# EAGLE design miniecu-v1.0c (EAGLE 6.5.0)
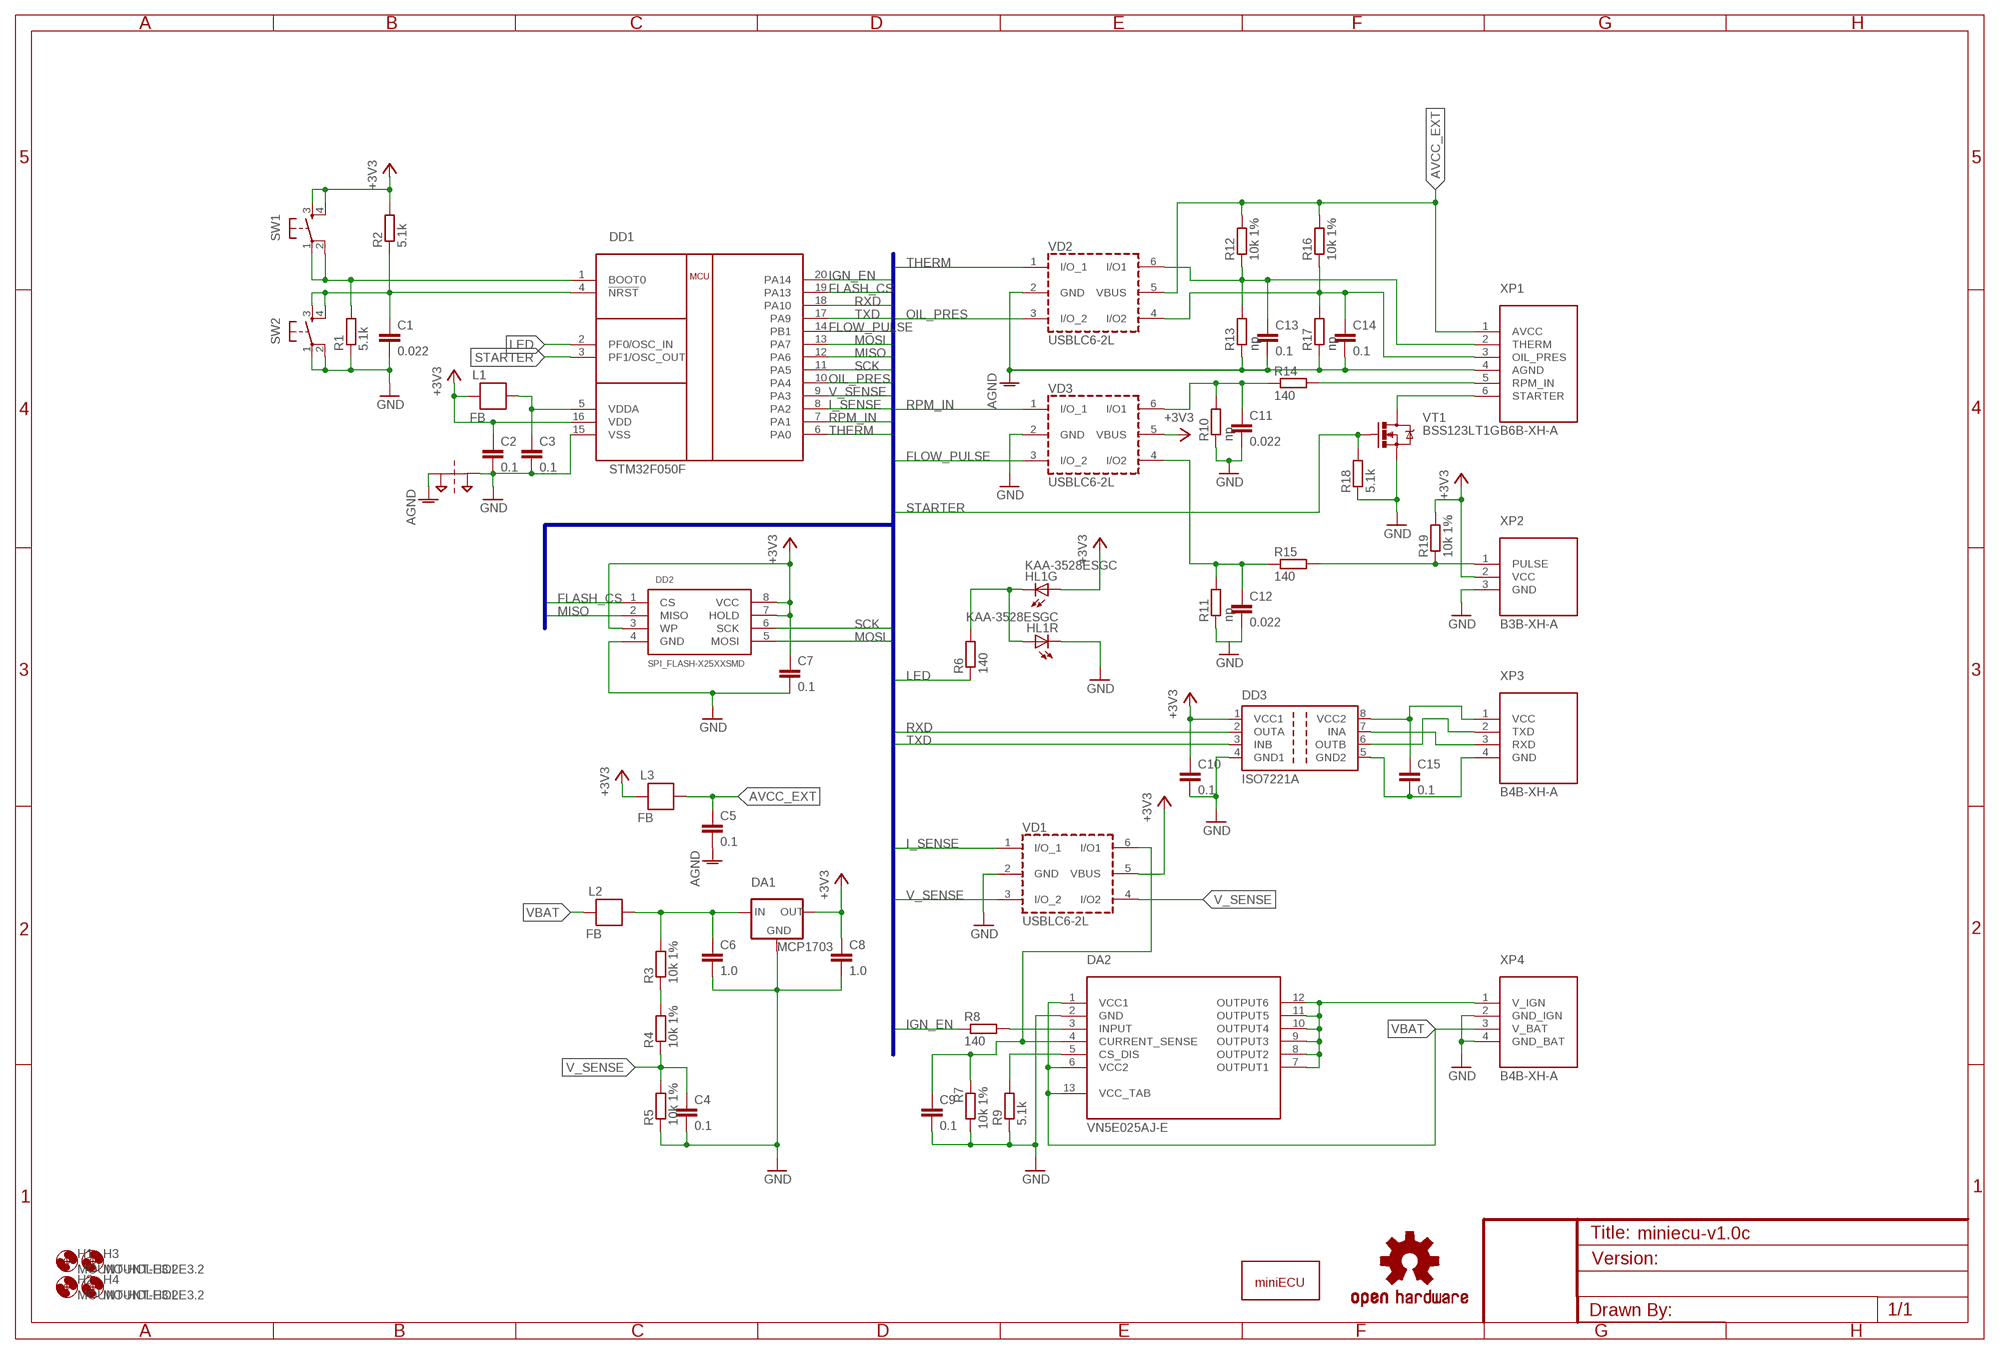
[diagram p0: schematic, sheet 1]

## Parts
C1  0.022  C-EUC0603  [C0603]
C2  0.1  C-EUC0603  [C0603]
C3  0.1  C-EUC0603  [C0603]
C4  0.1  C-EUC0603  [C0603]
C5  0.1  C-EUC0603  [C0603]
C6  1.0  C-EUC0805  [C0805]
C7  0.1  C-EUC0603  [C0603]
C8  1.0  C-EUC0805  [C0805]
C9  0.1  C-EUC0603  [C0603]
C10  0.1  C-EUC0603  [C0603]
C11  0.022  C-EUC0603  [C0603]
C12  0.022  C-EUC0603  [C0603]
C13  0.1  C-EUC0603  [C0603]
C14  0.1  C-EUC0603  [C0603]
C15  0.1  C-EUC0603  [C0603]
DA1  MCP1703  MCP1700SOT-23  [SOT23]
DA2  VN5E025AJ-E  [POWERSSO-12]
DD1  STM32F050F  [TSSOP20]
DD2  SPI_FLASH-X25XXSMD  [SO08]
DD3  ISO7221A  [SO-08]
H1  MOUNT-HOLE3.2  [3,2]
H2  MOUNT-HOLE3.2  [3,2]
H3  MOUNT-HOLE3.2  [3,2]
H4  MOUNT-HOLE3.2  [3,2]
HL1  KAA-3528ESGC  [KA-3528]
L1  FB  [0603]
L2  FB  [0603]
L3  FB  [0603]
LOGO1  OSHW-LOGOL  [OSHW-LOGO-L]
LOGO2  MINIECU_LOGO  [MINIECU_LOGO]
PT1  2PT_GND_TIE  [2PT_GND_TIE]
R1  5.1k  R-EU_R0603  [R0603]
R2  5.1k  R-EU_R0603  [R0603]
R3  10k 1%  R-EU_R0805  [R0805]
R4  10k 1%  R-EU_R0805  [R0805]
R5  10k 1%  R-EU_R0805  [R0805]
R6  140  R-EU_R0603  [R0603]
R7  10k 1%  R-EU_R0805  [R0805]
R8  140  R-EU_R0603  [R0603]
R9  5.1k  R-EU_R0603  [R0603]
R10  np  R-EU_R0603  [R0603]
R11  np  R-EU_R0603  [R0603]
R12  10k 1%  R-EU_R0805  [R0805]
R13  np  R-EU_R0805  [R0805]
R14  140  R-EU_R0603  [R0603]
R15  140  R-EU_R0603  [R0603]
R16  10k 1%  R-EU_R0805  [R0805]
R17  np  R-EU_R0805  [R0805]
R18  5.1k  R-EU_R0603  [R0603]
R19  10k 1%  R-EU_R0805  [R0805]
SW1  TAC_SWITCHSMD  [TACTILE_SWITCH_SMD]
SW2  TAC_SWITCHSMD  [TACTILE_SWITCH_SMD]
VD1  USBLC6-2L  USBLC6-2SC6  [SOT-23-6L]
VD2  USBLC6-2L  USBLC6-2SC6  [SOT-23-6L]
VD3  USBLC6-2L  USBLC6-2SC6  [SOT-23-6L]
VT1  BSS123LT1G  MOSFET-NCHANNELBSS123LT1G  [SOT23]
XP1  B6B-XH-A  SENSORS-B6B-XH-A  [B6B-XH]
XP2  B3B-XH-A  FLOW_SENS-B3B-XH-A  [B3B-XH]
XP3  B4B-XH-A  UART-B4B-XH-A  [B4B-XH]
XP4  B4B-XH-A  IGN_POWER-B4B-XH-A  [B4B-XH]

## Nets
!NRST: C1.1 DD1.4(!NRST) R2.1 SW2.3 SW2.4
+3V3: C2.1 C7.1 C8.1 C10.1 DA1.2(OUT) DD1.16(VDD) DD2.3(WP) DD2.7(HOLD) DD2.8(VCC) DD3.1(VCC1) HL1.4(G:A) L1.2 L3.2 R2.2 R19.2 SW1.3 SW1.4 VD1.5(VBUS) VD3.5(VBUS) XP2.2(VCC)
AGND: C5.2 C13.2 C14.2 PT1.P$1 R13.1 R17.1 VD2.2(GND) XP1.4(AGND)
AVCC: C3.1 DD1.5(VDDA) L1.1
AVCC_EXT: C5.1 L3.1 R12.2 R16.2 VD2.5(VBUS) XP1.1(AVCC)
BOOT0: DD1.1(BOOT0) R1.2 SW1.1 SW1.2
FLASH_CS: DD1.19(PA13) DD2.1(CS)
FLOW_PULSE: C12.1 DD1.14(PB1) R11.2 R15.1 VD3.3(I/O_2) VD3.4(I/O2)
GND: C1.2 C2.2 C3.2 C4.2 C6.2 C7.2 C8.2 C9.2 C10.2 C11.2 C12.2 DA1.1(GND) DA2.2(GND) DD1.15(VSS) DD2.4(GND) DD3.4(GND1) HL1.1(R:C) PT1.P$2 R1.1 R5.1 R7.2 R9.1 R10.1 R11.1 R18.1 SW2.1 SW2.2 VD1.2(GND) VD3.2(GND) VT1.2(S) XP2.3(GND) XP4.2(GND_IGN) XP4.4(GND_BAT)
GND2: C15.2 DD3.5(GND2) XP3.4(GND)
I_SENSE: C9.1 DA2.4(CURRENT_SENSE) DD1.8(PA2) R7.1 VD1.1(I/O_1) VD1.6(I/O1)
IGN_EN: DD1.20(PA14) R8.1
IORXD: DD3.7(INA) XP3.3(RXD)
IOTXD: DD3.6(OUTB) XP3.2(TXD)
LED: DD1.2(PF0/OSC_IN) R6.1
MISO: DD1.12(PA6) DD2.2(MISO)
MOSI: DD1.13(PA7) DD2.5(MOSI)
N$1: R3.1 R4.2
N$2: HL1.2(R:A) HL1.3(G:C) R6.2
N$4: R15.2 R19.1 XP2.1(PULSE)
N$6: C6.1 DA1.3(IN) L2.1 R3.2
N$7: DA2.3(INPUT) R8.2
N$9: DA2.5(CS_DIS) R9.2
OIL_PRES: C14.1 DD1.10(PA4) R16.1 R17.2 VD2.3(I/O_2) VD2.4(I/O2) XP1.3(OIL_PRES)
RPM_IN: C11.1 DD1.7(PA1) R10.2 R14.1 VD3.1(I/O_1) VD3.6(I/O1)
RPM_IN_CON: R14.2 XP1.5(RPM_IN)
RXD: DD1.18(PA10) DD3.2(OUTA)
SCK: DD1.11(PA5) DD2.6(SCK)
STARTER: DD1.3(PF1/OSC_OUT) R18.2 VT1.1(G)
STARTER_OUT: VT1.3(D) XP1.6(STARTER)
THERM: C13.1 DD1.6(PA0) R12.1 R13.2 VD2.1(I/O_1) VD2.6(I/O1) XP1.2(THERM)
TXD: DD1.17(PA9) DD3.3(INB)
V_IGN: DA2.7(OUTPUT1) DA2.8(OUTPUT2) DA2.9(OUTPUT3) DA2.10(OUTPUT4) DA2.11(OUTPUT5) DA2.12(OUTPUT6) XP4.1(V_IGN)
V_SENSE: C4.1 DD1.9(PA3) R4.1 R5.2 VD1.3(I/O_2) VD1.4(I/O2)
VBAT: DA2.1(VCC1) DA2.6(VCC2) DA2.13(VCC_TAB) L2.2 XP4.3(V_BAT)
VCC2: C15.1 DD3.8(VCC2) XP3.1(VCC)

## Buses
TXD,RXD,RPM_IN,FLOW_PULSE,STARTER,THERM,OIL_PRES,MISO,MOSI,SCK,FLASH_CS,IGN_EN,V_SENSE,I_SENSE,LED_RED

## Library data of the parts
C1-C15 = resistor:C-EU: CAPACITOR, European symbol
DA1 = power-ic:MCP1700: VOLTAGE REGULATOR
DA2 = power-ic:VN5E025AJ: Single channel high-side driver with analog current sense for automotive applications Features Max supply voltage VCC 41 V Operating voltage range VCC 4.5 to 28 V Max On-State resistance RON 25 mΩ Current limitation (typ) ILIMH 60 A Off state supply current IS 2 μA
DD1 = stm32f050:STM32F050F: STM32F050F - Coretex-M0 48 MHz; 4 kB RAM; 16/32 kB FLASH
DD2 = SparkFun-DigitalIC:SPI_FLASH-X25XX: 8pin SPI Flash series x25xx. Works with devices like W25X32 and BR25L32
DD3 = texas:ISO7221: DUAL DIGITAL ISOLATORS Source: http://focus.ti.com/lit/ds/symlink/iso7221a.pdf; MPN: ISO7221AD; OC_FARNELL: 1390651; OC_NEWARK: 48M0672
H1-H4 = holes:MOUNT-HOLE: MOUNTING HOLE with drill center marker
HL1 = led2:KAA-3528ESGC: KAA-3528ESGC Kingbright® 3.5x2.8mm SURFACE MOUNT LED LAMPS
L1-L3 = SparkFun-Passives:FB
LOGO1 = SparkFun-Aesthetics:OSHW-LOGO: Open Source Hardware Logo This logo indicates the piece of hardware it is found on incorporates a OSHW license and/or adheres to the definition of open source hardware found here: http://freedomdefined.org/OSHW
LOGO2 = miniecu:MINIECU_LOGO: Logo imported from bmp.
PT1 = SparkFun-Passives:2PT_GND_TIE: Package for connecting two ground nets in one place.
R1-R19 = resistor:R-EU_: RESISTOR, European symbol
SW1 SW2 = SparkFun-Electromechanical:TAC_SWITCH: Momentary Switch Button commonly used for reset or general input. Spark Fun Electronics SKU : COM-00097 SMT- SWCH-08247; PROD_ID: SWCH-08247
VD1-VD3 = usblc6:USBLC6-2: VERY LOW CAPACITANCE ESD PROTECTION 2 line Datasheet link <http://www.st.com/web/catalog/sense_power/FM114/CL1137/SC1489/PF93353>
VT1 = SparkFun-DiscreteSemi:MOSFET-NCHANNEL: Common NMOSFET Parts MFG P/N Store ID Prod ID FDD8780 TRANS-09984 SI7820DN TRANS-11055 FDS6630A IC-08089 2N7002PW TRANS-11151 FQP30N06L COM-10213 TRANS-10060 BSS123LT1G TRANS-08345 BSS138 TRANS-00830 BS170 2N7000; PROD_ID: TRANS-08345
XP1 = miniecu-con:SENSORS: JST XH CONNECTOR JST XH connector for engine sensors
XP2 = miniecu-con:FLOW_SENS: JST XH CONNECTOR B3B-XH JST connector for various liquid flow meters
XP3 = miniecu-con:UART: JST XH CONNECTOR Connector for isolated UART
XP4 = miniecu-con:IGN_POWER: JST XH CONNECTOR Connector for ingition module power switch

## Board
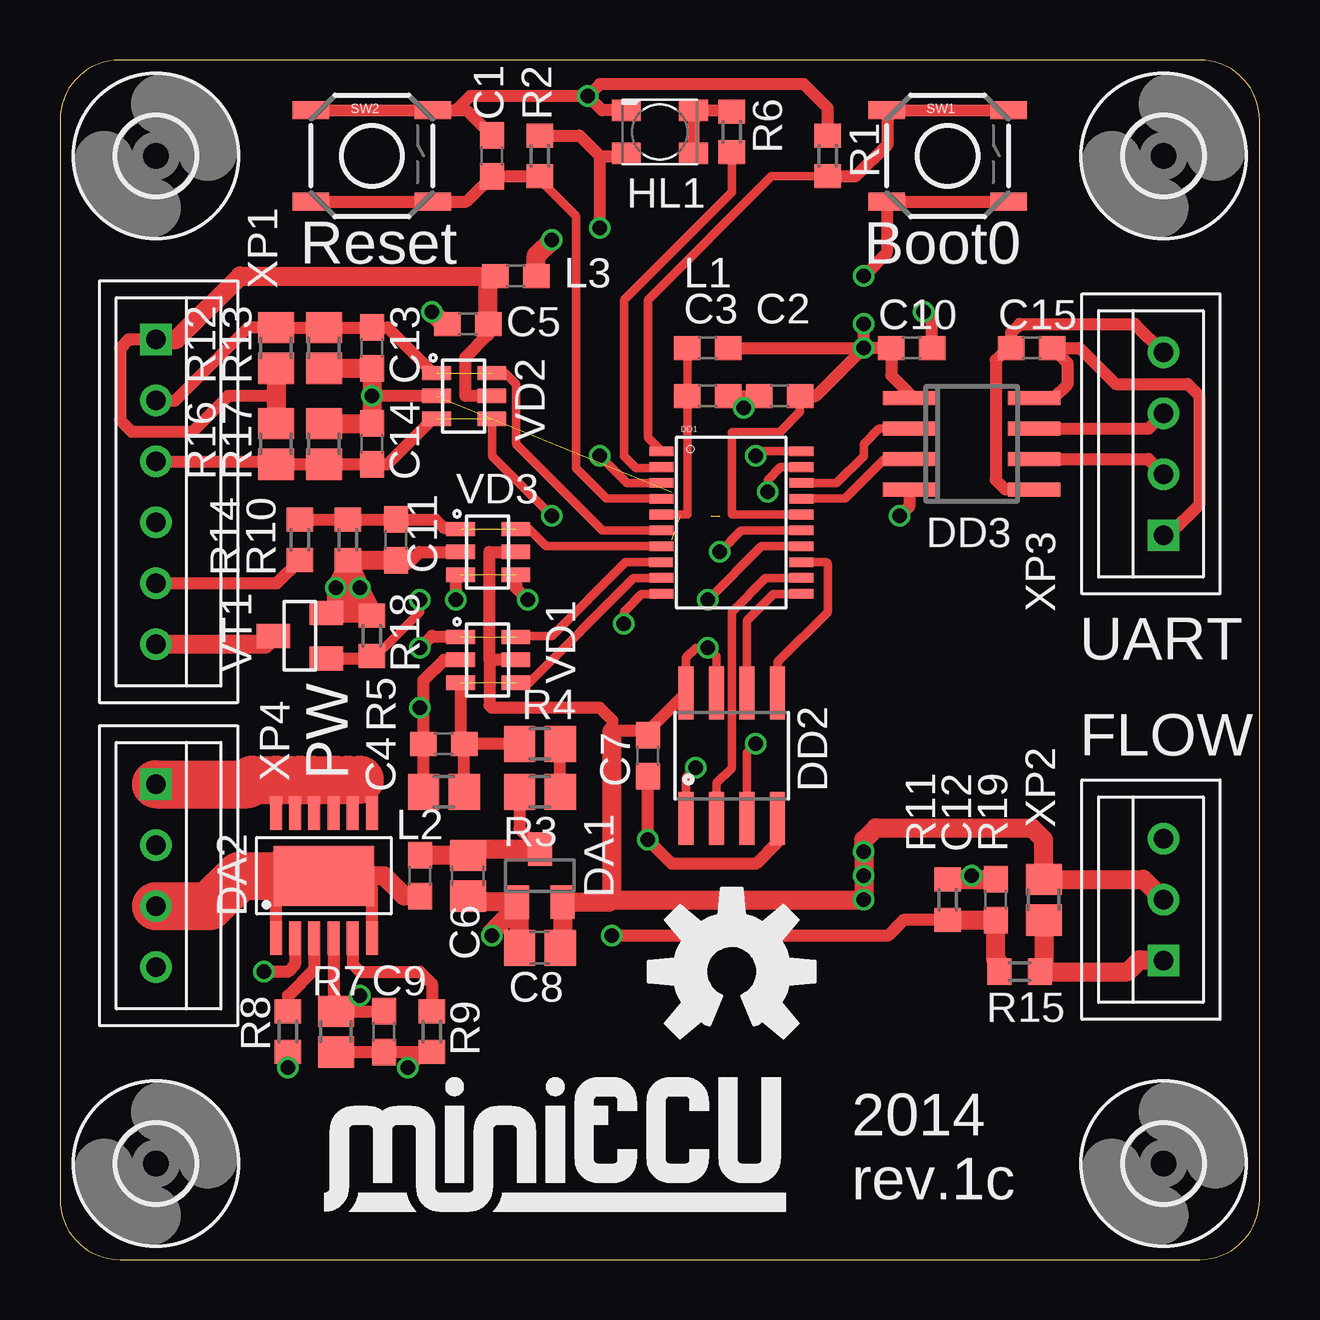
[diagram p1: board, top side]
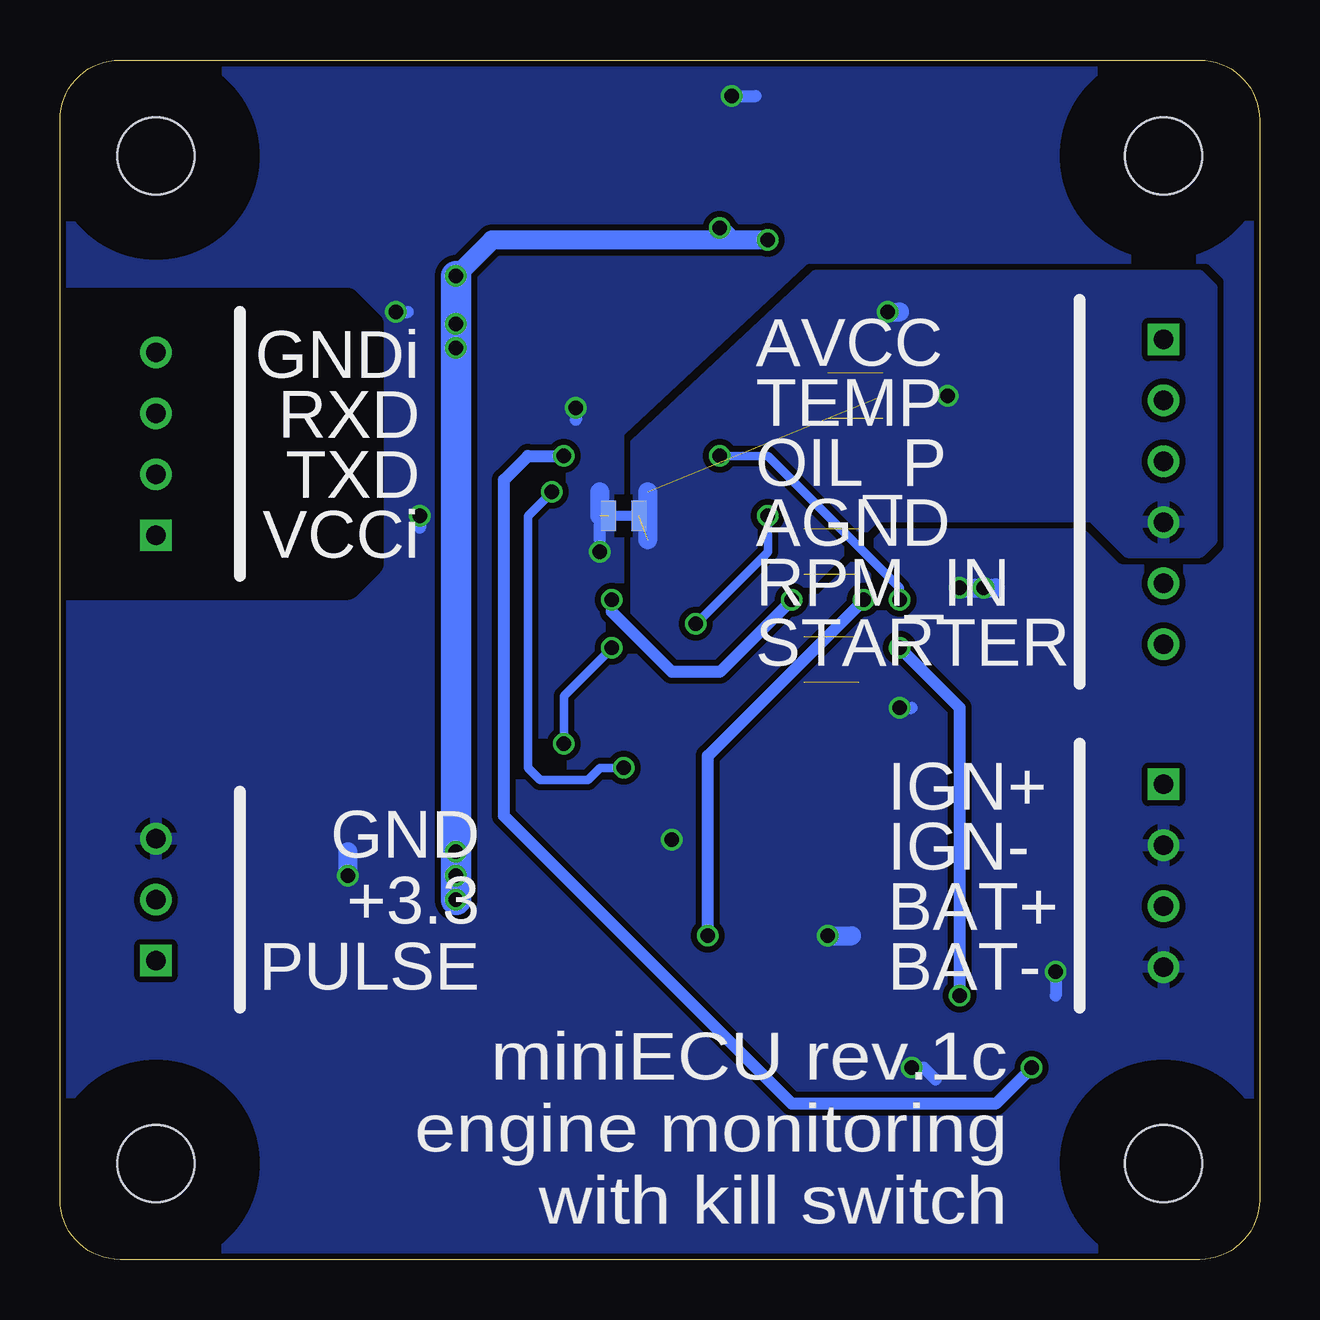
[diagram p2: board, bottom side, seen from below]

Size 50 x 50 mm. Coordinates in mm from the lower left corner, seen from the top.
Outline: 0,2.5 arc90 2.5,0 47.5,0 arc90 50,2.5 50,47.5 arc90 47.5,50 2.5,50 arc90 0,47.5 0,2.5
Copper layers (1*16): Top 0.035mm / dielectric 1.5mm / Bottom 0.035mm
Design rules "ITEADstudio_DRC": minimum track width 6mil, minimum drill 12mil, track to track 6mil, track to pad 6mil, pad to pad 6mil, via to via 6mil, smd to smd 0mil, copper to edge 10mil, drill to drill 10mil, minimum pad ring 10mil, minimum via ring 6mil, stop-mask expansion 2mil, vias tented up to drill 100mil, thermal gap 10mil
bRestrict: area 37,28 to 50,40

### Footprints (pad centres in the part's own frame; a part is rotated, then mirrored left to right if it is on the bottom)
C0603 = smd 1.1 x 1: 1 -0.85,0; 2 0.85,0
C0805 = smd 1.3 x 1.5: 1 -0.85,0; 2 0.85,0
SOT23 = smd 1 x 1.4: 1 -0.95,-1.1; 2 0.95,-1.1; 3 0,1.1
POWERSSO-12 = smd 0.5 x 1.4: 1 -2,-2.6; 2 -1.2,-2.6; 3 -0.4,-2.6; 4 0.4,-2.6; 5 1.2,-2.6; 6 2,-2.6; 7 2,2.6; 8 1.2,2.6; 9 0.4,2.6; 10 -0.4,2.6; 11 -1.2,2.6; 12 -2,2.6 | smd 4.2 x 2.5: 13 0,0
TSSOP20 = smd 1 x 0.4: 1 -2.937,2.693; 2 -2.937,2.032; 3 -2.937,1.372; 4 -2.937,0.712; 5 -2.937,0.051; 6 -2.937,-0.609; 7 -2.937,-1.27; 8 -2.943,-1.93; 9 -2.937,-2.59; 10 -2.937,-3.251; 11 2.905,-3.251; 12 2.905,-2.59; 13 2.911,-1.93; 14 2.905,-1.27; 15 2.905,-0.609; 16 2.905,0.051; 17 2.905,0.712; 18 2.905,1.372; 19 2.905,2.032; 20 2.905,2.693
SO08 = smd 0.61 x 2.21: 1 -1.905,-2.616; 2 -0.635,-2.616; 3 0.635,-2.616; 4 1.905,-2.616; 5 1.905,2.616; 6 0.635,2.616; 7 -0.635,2.616; 8 -1.905,2.616
SO-08 = smd 0.6 x 2.2: 1 -1.905,-2.6; 2 -0.635,-2.6; 3 0.635,-2.6; 4 1.905,-2.6; 5 1.905,2.6; 6 0.635,2.6; 7 -0.635,2.6; 8 -1.905,2.6
3,2 = hole 3.2: 0,0
KA-3528 = smd 1.2 x 0.9: 1 1.4,-0.9; 2 -1.4,-0.9; 3 -1.4,0.9; 4 1.4,0.9
0603 = smd 1.1 x 1: 1 -0.85,0; 2 0.85,0
2PT_GND_TIE = smd 1.27 x 0.635: P$1 0,0.635; P$2 0,-0.635
R0603 = smd 1 x 1.1: 1 -0.85,0; 2 0.85,0
R0805 = smd 1.3 x 1.5: 1 -0.85,0; 2 0.85,0
TACTILE_SWITCH_SMD = smd 1.524 x 0.762: 1 -2.54,1.905; 2 2.54,1.905; 3 -2.54,-1.905; 4 2.54,-1.905
SOT-23-6L = smd 0.6 x 1.2: 1 -0.95,-2.3; 2 0,-2.3; 3 0.95,-2.3; 4 0.95,0; 5 0,0; 6 -0.95,0
B6B-XH = drill 0.8 square: 1 -6.35,0 | drill 0.8: 2 -3.81,0; 3 -1.27,0; 4 1.27,0; 5 3.81,0; 6 6.35,0
B3B-XH = drill 0.8 square: 1 -2.54,0 | drill 0.8: 2 0,0; 3 2.54,0
B4B-XH = drill 0.8 square: 1 -3.81,0 | drill 0.8: 2 -1.27,0; 3 1.27,0; 4 3.81,0

### Placement (x,y rotation side)
C1  18,46 90 top
C2  30,36 180 top
C3  27,36 0 top
C4  16,21.5 180 top
C5  17,39 180 top
C6  17,16 270 top
C7  24.5,21 270 top
C8  20,13 180 top
C9  13.5,9.5 270 top
C10  35.5,38 0 top
C11  14,30 270 top
C12  39,15 90 top
C13  13,38 270 top
C14  13,34 90 top
C15  40.5,38 180 top
DA1  20,16 0 top
DA2  11,16 0 top
DD1  28,31 0 top
DD2  28,21 0 top
DD3  38,34 270 top
H1  46,4 0 top
H2  4,4 0 top
H3  4,46 0 top
H4  46,46 0 top
HL1  25,47 180 top
L1  27,38 0 top
L2  15,16 270 top
L3  19,41 0 top
LOGO1  28,12 0 top
LOGO2  11,2 0 top
PT1  26.5,31 270 bottom
R1  32,46 270 top
R2  20,46 90 top
R3  20,19.5 180 top
R4  20,21.5 0 top
R5  16,19.5 0 top
R6  28,47 90 top
R7  11.5,9.5 270 top
R8  9.5,9.5 90 top
R9  15.5,9.5 90 top
R10  12,30 90 top
R11  37,15 270 top
R12  9,38 270 top
R13  11,38 90 top
R14  10,30 270 top
R15  40,12 0 top
R16  9,34 90 top
R17  11,34 270 top
R18  13,26 270 top
R19  41,15 90 top
SW1  37,46 0 top
SW2  13,46 0 top
VD1  19,25 270 top
VD2  18,36 270 top
VD3  19,29.5 270 top
VT1  10,26 90 top
XP1  4,32 270 top
XP2  46,15 90 top
XP3  46,34 90 top
XP4  4,16 270 top

### Tracks (layer width: path | path; a pad name or v marks a point on that pad's centre or on a via)
!NRST
  Top 0.35: DD1.4 22.79,31.71 21.5,33 21.5,43.5 20,45 R2.1
  Top 0.5: SW2.3 SW2.4 16.95,44.09 C1.1 R2.1
+3V3  (via drill 0.6)
  Top 0.35: DD2.7 27.36,25.14 v27,25.5 26.5,25.5 26.09,25.09 DD2.8 | DD2.3 28.64,21.14 v29,21.5 | DD1.16 28,31.05 28,34.5 30,34.5 30.85,35.35 C2.1
  Top 0.5: R2.2 21.65,46.85 22.5,46 | 22.5,46 23.5,46 HL1.4 | VD1.5 17.9,25 | 17.9,25 17.9,29.5 VD3.5 | C7.1 24.5,22.02 | 24.5,22.02 DD2.8 | 17.9,25 17.9,23.1 18,23 22.5,23 23.02,22.48 23.02,22.02 | 24.5,22.02 23.02,22.02 | 23.02,22.02 23,22 | v22.5,43 22.5,46 | SW1.4 SW1.3 34.46,41.96 v33.5,41 | L1.2 v33.5,38 | v33.5,38 C10.1 34.65,36.85 35.4,36.1 DD3.1 | v33.5,38 v33.5,39 | C2.1 31.5,36 v33.5,38
  Top 0.8: C8.1 20.95,13.1 DA1.2 22.9,14.9 23,15 | XP2.2 45.15,15.85 R19.2 41,17.5 40.5,18 34,18 33.5,17.5 v33.5,17 v33.5,16 v33.5,15 23,15 | 23,15 23,22 | L3.2 19.85,41.85 v20.5,42.5
  Bottom 0.35: v29,21.5 29,23.5 v27,25.5
  Bottom 0.8: v33.5,41 32,42.5 v20.5,42.5 22,42.5 v22.5,43
  Bottom 1.27: v33.5,15 v33.5,16 v33.5,17 v33.5,38 v33.5,39 v33.5,41
AGND  (via drill 0.6)  (2 unrouted)
  Top 0.5: VD2.2 v13,36
  Top 0.8: R13.1 C13.2 v13,36 C14.2 R17.1 | C5.2 16,39 v15.5,39.5
  Bottom 0.8: v15.5,39.5 15,39.5 | 25.5,30 25.5,32
  pour Bottom (isolate 0.254): 5.5,29.5 2.5,29.5 2,30 2,40.5 2.5,41 18.5,41 26,34 26,26.5 24.5,25 22,25 16,31 7,31
AVCC
  Top 0.35: L1.1 C3.1 26.15,31.05 DD1.5
AVCC_EXT
  Top 0.5: VD2.5 16.9,36 16.9,37.6 17.85,38.55 C5.1 | 9,36 7,36 5.5,34.5 3,34.5 2.5,35 2.5,38 2.85,38.35 XP1.1
  Top 0.8: R12.2 9,36 R16.2 | XP1.1 4.85,38.35 7.5,41 L3.1 17.85,40.7 C5.1
BOOT0
  Top 0.35: DD1.1 24.5,34.26 24.5,40 29.65,45.15 R1.2
  Top 0.5: SW1.2 SW1.1 34.5,47.87 34.5,46.5 33.15,45.15 R1.2
FLASH_CS  (via drill 0.6)
  Top 0.35: DD2.1 26.09,20.09 v26.5,20.5 | v29.5,32 29.5,32.5 30.03,33.03 DD1.19
  Bottom 0.35: v26.5,20.5 27.5,20.5 28,20 30,20 30.5,20.5 30.5,31 v29.5,32
FLOW_PULSE  (via drill 0.6)  (1 unrouted)
  Top 0.35: DD1.14 29.23,29.73 v27,27.5
  Top 0.5: R11.2 35.15,14.15 34.5,13.5 v23,13.5 | v16.5,27.5 16.5,28.35 VD3.3 | VD3.4 19,28 v19.5,27.5
  Top 0.8: R11.2 C12.1 39,12.5 39.15,12.35 R15.1
  Bottom 0.5: v23,13.5 23,21 v16.5,27.5 | v19.5,27.5 22.5,24.5 24.5,24.5 27,27 v27,27.5
GND  (via drill 0.6)  (1 unrouted)
  Top 0.35: DD1.15 28.39,30.39 v27.5,29.5
  Top 0.5: C11.2 14.15,29 14.5,29 15,29.5 VD3.2 | VD1.2 16,25 15.15,24.15 C4.2 R5.1 15.15,22.85 v15,23 | R7.2 C9.2 R9.1 15.15,8.65 v14.5,8 | DA2.2 9.8,12.3 9.5,12 v8.5,12 | SW2.1 SW2.2 16.5,47.91 | 16.5,47.91 16.95,47.91 C1.2 | v22,48.5 17.09,48.5 16.5,47.91 | R1.1 32,48 31,49 22.5,49 v22,48.5 | HL1.1 22.6,47.9 v22,48.5 | C2.2 C3.2 28,36 v28.5,35.5 | DD3.4 35.4,31.4 v35,31 | C10.2 36.35,39.15 v36,39.5 | DD2.4 29.91,17.41 29,16.5 25.5,16.5 v24.5,17.5 C7.2
  Top 0.8: v12.5,28 R10.1 C11.2 | VT1.2 12.9,26.95 R18.1 13,27 | 13,27 v12.5,28 | C8.2 19.15,14.8 | 19.15,14.8 DA1.1 17.25,14.9 C6.2 | 19.15,14.8 18,13.65 v18,13.5 | C12.2 R11.1 37.85,15.85 v38,16 | v11.5,28 11.5,27 | v11.5,28 12,29 | v11.5,28 v12.5,28 | v11.5,28 13,27
  Bottom 0.35: v27.5,29.5 27.5,30
  Bottom 0.5: v15,23 14.5,23 | v14.5,8 14,8 13.5,7.5 | v8.5,12 8.5,11 | v22,48.5 21,48.5 | v28.5,35.5 28.5,35 | v35,31 35,30.5 | v36,39.5 35.5,39.5 | 27.5,30 27.5,30.64 PT1.P$2
  Bottom 0.8: v12.5,28 11,28 | v18,13.5 17,13.5 | v38,16 38,17 | 27.5,31 27.5,32
  pour Bottom (isolate 0.254, rank 2): 2.5,50 47.5,50 arc-90 50,47.5 50,2.5 arc-90 47.5,0 2.5,0 arc-90 0,2.5 0,47.5 arc-90
GND2
  Top 0.5: XP3.4 44.81,39 40,39 39.65,38.65 C15.2 39.5,38 39,37.5 39,32.5 39.41,32.09 DD3.5
I_SENSE  (via drill 0.6)  (1 unrouted)
  Top 0.35: DD1.8 23.57,29.07 20.5,26 19.05,26 VD1.6
  Top 0.5: C9.1 R7.1 11.4,10.45 DA2.4 11.4,10.6 11.5,10.5 12,10.5 v12.5,11 | v15,25.5 15.5,26 15.55,25.95 VD1.1
  Bottom 0.5: v12.5,11 12.5,23 v15,25.5
IGN_EN  (via drill 0.6)
  Top 0.35: DD1.20 29.19,33.69 v29,33.5
  Top 0.5: R8.1 v9.5,8
  Bottom 0.5: v9.5,8 11,6.5 19.5,6.5 31.5,18.5 31.5,32.5 30.5,33.5 v29,33.5
IORXD
  Top 0.5: DD3.7 45.37,34.63 XP3.3
IOTXD
  Top 0.5: DD3.6 45.37,33.37 XP3.2
LED
  Top 0.35: DD1.2 25.03,33 24,33 23.5,33.5 23.5,40 28,44.5 R6.1
MISO
  Top 0.35: DD1.12 29.41,28.41 28,27 28,20.5 27.36,19.86 DD2.2
MOSI
  Top 0.35: DD1.13 31.93,29.07 32,29 32,27 29.91,24.91 DD2.5
N$1
  Top 0.5: R3.1 R4.2
N$2
  Top 0.5: R6.2 27.95,47.9 HL1.2 HL1.3
N$4
  Top 0.8: XP2.1 45.96,12.5 45,12.5 44.5,12 R15.2 41,12.15 R19.1
N$6
  Top 0.5: R3.2 19.15,17.95 DA1.3
  Top 0.8: L2.1 C6.1 17.25,17.1 DA1.3
N$7
  Top 0.5: DA2.3 10.6,12.1 9.5,11 R8.2
N$9
  Top 0.5: DA2.5 12.2,12.3 12.5,12 15,12 15.5,11.5 R9.2
OIL_PRES  (via drill 0.6)  (1 unrouted)
  Top 0.35: VD2.4 18,33.5 v20.5,31 | v23.5,26.5 23.5,27 24.25,27.75 DD1.10
  Top 0.5: XP1.3 8.88,33.27 | R16.1 R17.2 C14.1 13.65,33.15 15.55,35.05 VD2.3
  Top 0.8: 8.88,33.27 R16.1
  Bottom 0.35: v20.5,31 20.5,29.5 v23.5,26.5
RPM_IN  (1 unrouted)
  Top 0.35: DD1.7 20.27,29.73 19.5,30.5 19.05,30.5 VD3.6
  Top 0.5: R14.1 R10.2 C11.1 15.65,30.85 16,30.5 16.65,30.5 VD3.1
RPM_IN_CON
  Top 0.5: XP1.5 9.04,28.19 R14.2
RXD
  Top 0.35: DD1.18 32.37,32.37 33.5,33.5 33.5,34 34.13,34.63 DD3.2
SCK
  Top 0.35: DD1.11 29.75,27.75 28.64,26.64 DD2.6
STARTER  (via drill 0.6)
  Top 0.35: DD1.3 23.63,32.37 v22.5,33.5 | v15,27.5 15,27 13.5,25.5 13.35,25.5 R18.2
  Top 0.5: VT1.1 12.9,25.05 R18.2
  Bottom 0.35: v22.5,33.5 20.5,33.5 15,28 v15,27.5
STARTER_OUT
  Top 0.8: XP1.6 8.55,25.65 VT1.3
THERM  (1 unrouted)
  Top 0.35: DD1.6 22.61,30.39 19,34 19,36.5 18.5,37 18.05,37 VD2.6
  Top 0.5: XP1.2 4.81,35.81 7.85,38.85 R12.1 R13.2 C13.1 13.65,38.85 15.55,36.95 VD2.1
TXD
  Top 0.35: DD1.17 32.71,31.71 34.37,33.37 DD3.3
V_IGN
  Top 0.5: DA2.7 13,19.5 12.5,20 | DA2.8 12.2,19.8 12,20 | DA2.9 11.4,19.9 11.5,20 | DA2.10 10.6,19.9 10.5,20 | 10,20 9.8,19.8 DA2.11 9.8,19.7 9.5,20 | DA2.12 9,20
  Top 2: XP4.1 7.81,19.81 8,20 9,20 9.5,20 10,20 10.5,20 11.5,20 12,20 12.5,20
V_SENSE  (1 unrouted)
  Top 0.35: DD1.9 23.91,28.41 19.5,24 19.05,24 VD1.4
  Top 0.5: R5.2 C4.1 | VD1.3 16.7,21.65 C4.1 | R4.1 C4.1
VBAT
  Top 0.5: DA2.1 9,16 | DA2.6 13,16
  Top 0.8: L2.2 14.35,15.15 13.5,16 13,16 DA2.13
  Top 2: XP4.3 6.23,14.73 7.5,16 9,16 DA2.13
VCC2
  Top 0.5: XP3.1 46.19,30.19 47.5,31.5 47.5,36 47,36.5 44,36.5 42.5,38 C15.1 42,37.35 42,36.5 41.41,35.91 DD3.8

### Text on the board
tPlace: Reset | Boot0 | UART | FLOW | PW | 2014 / rev.1c
bPlace: AVCC | GNDi | TEMP | RXD | OIL_P | TXD | AGND | VCCi | RPM_IN | STARTER | IGN+ | GND | IGN- | BAT+ | +3.3 | BAT- | PULSE | miniECU rev.1c / engine monitoring / with kill switch